# EAGLE design master_taylor2 (EAGLE 7.1.0)
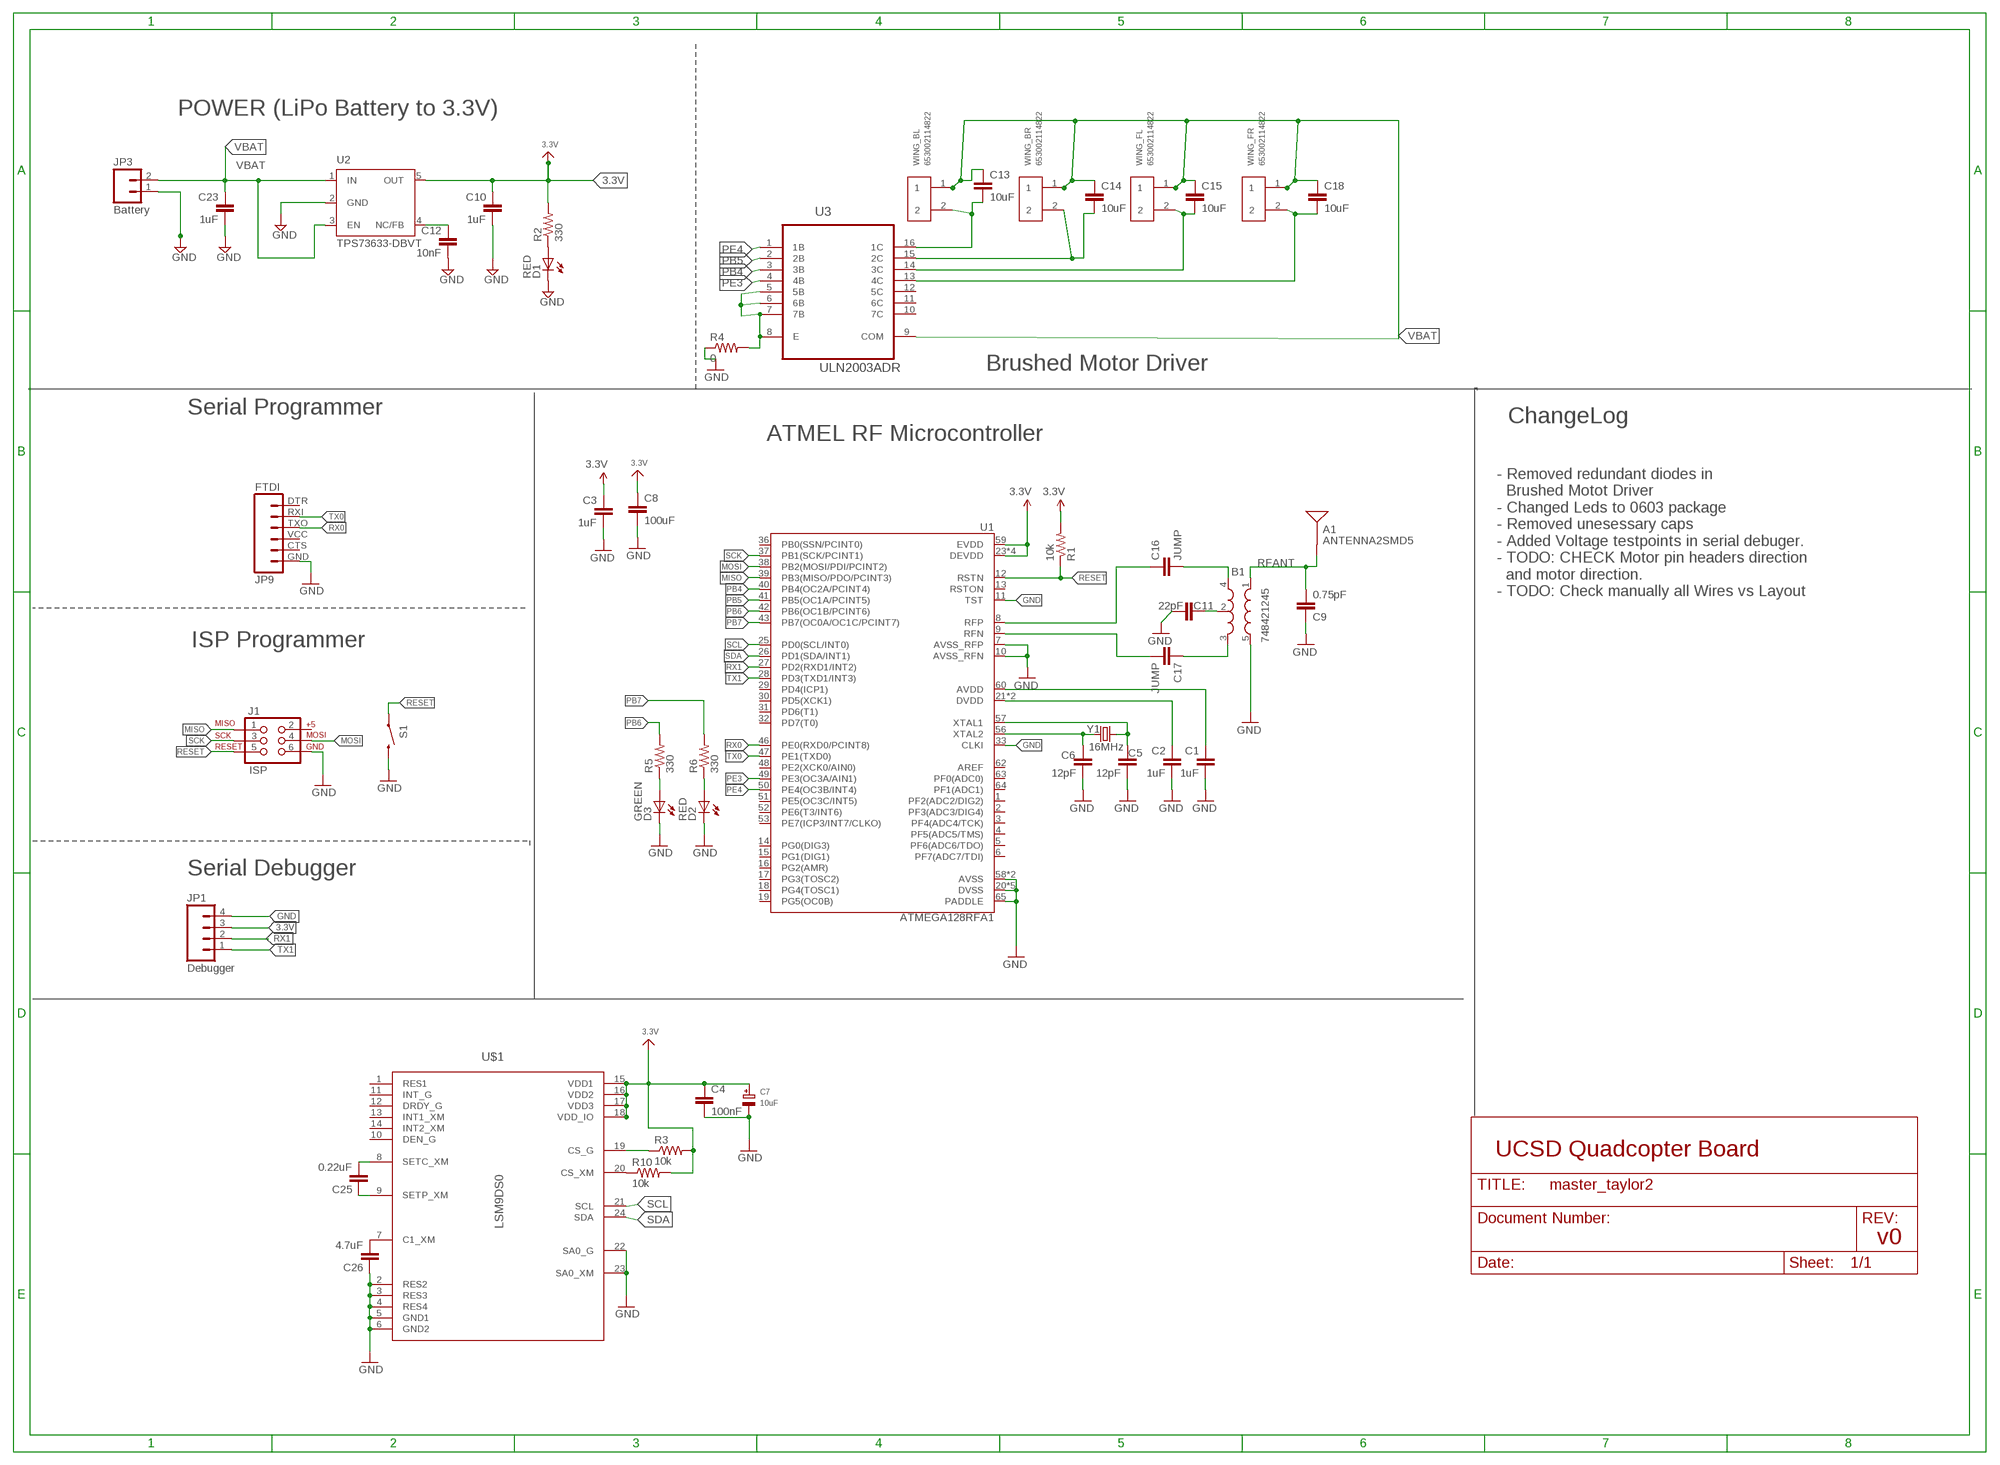
[diagram p0: schematic, sheet 1]

## Parts
A1  ANTENNA2SMD5  [ANTENNA-CHIP5]
B1  748421245  BALUN0805  [BALUN]
C1  1uF  CAP0603-CAP  [0603-CAP]
C2  1uF  CAP0603-CAP  [0603-CAP]
C3  1uF  CAP0603-CAP  [0603-CAP]
C4  100nF  CAP0603-CAP  [0603-CAP]
C5  12pF  CAP0603-CAP  [0603-CAP]
C6  12pF  CAP0603-CAP  [0603-CAP]
C7  10uF  CAP_TANTALUMA/3216_WAVE  [EIA3216-18/A-W]
C8  100uF  CAP1206  [1206]
C9  0.75pF  CAP0603-CAP  [0603-CAP]
C10  1uF  CAP0603-CAP  [0603-CAP]
C11  22pF  CAP0603-CAP  [0603-CAP]
C12  10nF  CAP0603-CAP  [0603-CAP]
C13  10uF  CAP0603-CAP  [0603-CAP]
C14  10uF  CAP0603-CAP  [0603-CAP]
C15  10uF  CAP0603-CAP  [0603-CAP]
C16  JUMP  CAP0603-CAP  [0603-CAP]
C17  JUMP  CAP0603-CAP  [0603-CAP]
C18  10uF  CAP0603-CAP  [0603-CAP]
C23  1uF  CAP0603-CAP  [0603-CAP]
C25  0.22uF  CAP0603-CAP  [0603-CAP]
C26  4.7uF  CAP0603-CAP  [0603-CAP]
D1  RED  LEDCHIPLED_0603  [CHIPLED_0603]
D2  RED  LEDCHIPLED_0603  [CHIPLED_0603]
D3  GREEN  LEDCHIPLED_0603  [CHIPLED_0603]
J1  ISP  AVR_SPI_PRG_6NS  [2X3-NS]
JP1  Debugger  M04PTH  [1X04]
JP3  Battery  M02PTH  [1X02]
JP9  FTDI  FTDI_BASICPTH  [FTDI_BASIC]
R1  10k  RESISTOR0603-RES  [0603-RES]
R2  330  RESISTOR0603-RES  [0603-RES]
R3  10k  RESISTOR0805-RES  [0805]
R4  0  RESISTOR0805-RES  [0805]
R5  330  RESISTOR0603-RES  [0603-RES]
R6  330  RESISTOR0603-RES  [0603-RES]
R10  10k  RESISTOR0805-RES  [0805]
S1  SWITCH-MOMENTARY-2SMD  [TACTILE_SWITCH_SMD]
U1  ATMEGA128RFA1  [QFN-64]
U2  TPS73633-DBVT  [SOT23-DBV]
U3  ULN2003ADR  [SOIC127P600X175-16N]
U$1  LSM9DS0  [LGA-24]
WING_BL  653002114822  [653002114822]
WING_BR  653002114822  [653002114822]
WING_FL  653002114822  [653002114822]
WING_FR  653002114822  [653002114822]
Y1  16MHz  CRYSTAL5X3  [CRYSTAL-SMD-5X3]

## Nets
3.3V: C3.1 C4.1 C7.+ C8.1 C10.1 JP1.3 R1.2 R2.2 R3.2 R10.2 U1.23(DEVDD) U1.34(DEVDD) U1.44(DEVDD) U1.54(DEVDD) U1.59(EVDD) U2.5(OUT) U$1.15(VDD1) U$1.16(VDD2) U$1.17(VDD3) U$1.18(VDD_IO)
AVDD: C1.1 U1.60(AVDD)
DVDD: C2.1 U1.21(DVDD) U1.22(DVDD)
GND: B1.5(GND) C1.2 C2.2 C3.2 C4.2 C5.2 C6.2 C7.- C8.2 C9.1 C10.2 C11.2 C12.2 C23.2 C26.1 D1.C D2.C D3.C J1.6 JP1.4 JP3.1 JP9.GND R4.1 S1.3 U1.7(AVSS_RFP) U1.10(AVSS_RFN) U1.11(TST) U1.20(DVSS) U1.24(DVSS) U1.33(CLKI) U1.35(DVSS) U1.45(DVSS) U1.55(DVSS) U1.58(AVSS) U1.61(AVSS) U1.65(PADDLE) U2.2(GND) U$1.2(RES2) U$1.3(RES3) U$1.4(RES4) U$1.5(GND1) U$1.6(GND2) U$1.22(SA0_G) U$1.23(SA0_XM)
MISO: J1.1 U1.39(PB3(MISO/PDO/PCINT3))
MOSI: J1.4 U1.38(PB2(MOSI/PDI/PCINT2))
N$1: C12.1 U2.4(NC/FB)
N$2: D1.A R2.1
N$3: C5.1 U1.57(XTAL1) Y1.3
N$4: C6.1 U1.56(XTAL2) Y1.1
N$7: B1.2(GND) C11.1
N$8: D3.A R5.1
N$10: B1.4(OUT1) C16.2
N$11: B1.3(OUT2) C17.1
N$12: R4.2 U3.5(5B) U3.6(6B) U3.7(7B) U3.8(E)
N$13: D2.A R6.1
N$20: C26.2 U$1.7(C1_XM)
N$21: C25.2 U$1.8(SETC_XM)
N$22: C25.1 U$1.9(SETP_XM)
N$23: R3.1 U$1.19(CS_G)
N$24: R10.1 U$1.20(CS_XM)
N$29: C13.2 U3.16(1C) WING_BL.2
N$30: C14.2 U3.15(2C) WING_BR.2
N$31: C15.2 U3.14(3C) WING_FL.2
N$32: C18.2 U3.13(4C) WING_FR.2
PB4: U1.40(PB4(OC2A/PCINT4)) U3.3(3B)
PB5: U1.41(PB5(OC1A/PCINT5)) U3.2(2B)
PB6: R5.2 U1.42(PB6(OC1B/PCINT6))
PB7: R6.2 U1.43(PB7(OC0A/OC1C/PCINT7))
PE3: U1.49(PE3(OC3A/AIN1)) U3.4(4B)
PE4: U1.50(PE4(OC3B/INT4)) U3.1(1B)
RESET: J1.5 R1.1 S1.1 U1.12(RSTN)
RFANT [RFSIG]: A1.FEED(SIGNAL) B1.1(IN) C9.2
RFN: C17.2 U1.9(RFN)
RFP: C16.1 U1.8(RFP)
RX0: JP9.TXO U1.46(PE0(RXD0/PCINT8))
RX1: JP1.2 U1.27(PD2(RXD1/INT2))
SCK: J1.3 U1.37(PB1(SCK/PCINT1))
SCL: U1.25(PD0(SCL/INT0)) U$1.21(SCL)
SDA: U1.26(PD1(SDA/INT1)) U$1.24(SDA)
TX0: JP9.RXI U1.47(PE1(TXD0))
TX1: JP1.1 U1.28(PD3(TXD1/INT3))
VBAT: C13.1 C14.1 C15.1 C18.1 C23.1 JP3.2 U2.1(IN) U2.3(EN) U3.9(COM) WING_BL.1 WING_BR.1 WING_FL.1 WING_FR.1
Unconnected: J1.2 JP9.CTS JP9.DTR JP9.VCC U1.1(PF2(ADC2/DIG2)) U1.2(PF3(ADC3/DIG4)) U1.3(PF4(ADC4/TCK)) U1.4(PF5(ADC5/TMS)) U1.5(PF6(ADC6/TDO)) U1.6(PF7(ADC7/TDI)) U1.13(RSTON) U1.14(PG0(DIG3)) U1.15(PG1(DIG1)) U1.16(PG2(AMR)) U1.17(PG3(TOSC2)) U1.18(PG4(TOSC1)) U1.19(PG5(OC0B)) U1.29(PD4(ICP1)) U1.30(PD5(XCK1)) U1.31(PD6(T1)) U1.32(PD7(T0)) U1.36(PB0(SSN/PCINT0)) U1.48(PE2(XCK0/AIN0)) U1.51(PE5(OC3C/INT5)) U1.52(PE6(T3/INT6)) U1.53(PE7(ICP3/INT7/CLKO)) U1.62(AREF) U1.63(PF0(ADC0)) U1.64(PF1(ADC1)) U3.10(7C) U3.11(6C) U3.12(5C) U$1.1(RES1) U$1.10(DEN_G) U$1.11(INT_G) U$1.12(DRDY_G) U$1.13(INT1_XM) U$1.14(INT2_XM)

## Notes on the sheet
- POWER (LiPo Battery to 3.3V)
- Brushed Motor Driver
- Serial Programmer
- ChangeLog
- ATMEL RF Microcontroller
- - Removed redundant diodes in 
    Brushed Motot Driver
  - Changed Leds to 0603 package
  - Removed unesessary caps
  - Added Voltage testpoints in serial debuger.
  - TODO: CHECK Motor pin headers direction
    and motor direction.
  - TODO: Check manually all Wires vs Layout
- ISP Programmer
- Serial Debugger
- UCSD Quadcopter Board
- v0

## Library data of the parts
A1 = SparkFun-RF:ANTENNA2: Chip antenna Single endded antenna. Common with smaller chip antennas. CHIP4 package is the GPS Chip Antenna SKU: GPS-08418. CHIP5 package is 2.4GHz chip antenna SKU: WRL-00144.
B1 = SparkFun-RF:BALUN: 0805 footprint balun- Ember 351/357
C1-C6 C8-C18 C23 C25 C26 = SparkFun-Capacitors:CAP: Capacitor Standard 0603 ceramic capacitor, and 0.1" leaded capacitor.
C7 = microbuilder:CAP_TANTALUM: Tantalum Capacitors Wave footprints have larger pads and are meant to be used for hand soldering. Reflow footprints are optimised for solder paste and a reflow oven. EIA3216-18/A-[R/W] - Size A / 3216-18 / 1206 footprint 4.7µF 25V 10% Tantalum Capacitor 10µF 16V 10% Tantalum Capacitor [Digikey: 495-2236-2-ND] EIA3528-21/B-[R/W] - Size B / 3528-21 47µF 10V 10% Tantalum Capactior [Digikey: 495-2216-1-ND] EIA6032-28/C-[R/W] - Size C / 6032-28 10µF 35V 20% Tantalum Capacitor [Digikey: 495-2285-1-ND] 100µF 16V 10% Tantalum Capactior [Digikey: 399-5214-1-ND]
D1-D3 = led:LED: LED OSRAM: - CHIPLED LG R971, LG N971, LY N971, LG Q971, LY Q971, LO R971, LY R971 LH N974, LH R974 LS Q976, LO Q976, LY Q976 LO Q996 - Hyper CHIPLED LW Q18S LB Q993, LB Q99A, LB R99A - SideLED LS A670, LO A670, LY A670, LG A670, LP A670 LB A673, LV A673, LT A673, LW A673 LH A674 LY A675 LS A676, LA A676, LO A676, LY A676, LW A676 LS A679, LY A679, LG A679 - Hyper Micro SIDELED® LS Y876, LA Y876, LO Y876, LY Y876 LT Y87S - SmartLED LW L88C, LW L88S LB L89C, LB L89S, LG L890 LS L89K, LO L89K, LY L89K LS L896, LA L896, LO L896, LY L896 - TOPLED LS T670, LO T670, LY T670, LG T670, LP T670 LSG T670, LSP T670, LSY T670, LOP T670, LYG T670 LG T671, LOG T671, LSG T671 LB T673, LV T673, LT T673, LW T673 LH T674 LS T676, LA T676, LO T676, LY T676, LB T676, LH T676, LSB T676, LW T676 LB T67C, LV T67C, LT T67C, LS T67K, LO T67K, LY T67K, LW E67C LS E67B, LA E67B, LO E67B, LY E67B, LB E67C, LV E67C, LT E67C LW T67C LS T679, LY T679, LG T679 LS T770, LO T770, LY T770, LG T770, LP T770 LB T773, LV T773, LT T773, LW T773 LH T774 LS E675, LA E675, LY E675, LS T675 LS T776, LA T776, LO T776, LY T776, LB T776 LHGB T686 LT T68C, LB T68C - Hyper Mini TOPLED® LB M676 - Mini TOPLED Santana® LG M470 LS M47K, LO M47K, LY M47K Source: http://www.osram.convergy.de LUXEON: - LUMILED® LXK2-PW12-R00, LXK2-PW12-S00, LXK2-PW14-U00, LXK2-PW14-V00 LXK2-PM12-R00, LXK2-PM12-S00, LXK2-PM14-U00 LXK2-PE12-Q00, LXK2-PE12-R00, LXK2-PE12-S00, LXK2-PE14-T00, LXK2-PE14-U00 LXK2-PB12-K00, LXK2-PB12-L00, LXK2-PB12-M00, LXK2-PB14-N00, LXK2-PB14-P00, LXK2-PB14-Q00 LXK2-PR12-L00, LXK2-PR12-M00, LXK2-PR14-Q00, LXK2-PR14-R00 LXK2-PD12-Q00, LXK2-PD12-R00, LXK2-PD12-S00 LXK2-PH12-R00, LXK2-PH12-S00 LXK2-PL12-P00, LXK2-PL12-Q00, LXK2-PL12-R00 Source: www.luxeon.com KINGBRIGHT: KA-3528ASYC Source: www.kingbright.com
J1 = SparkFun-Connectors:AVR_SPI_PRG_6: AVR ISP 6 Pin This is the reduced ISP connector for AVR programming. Common on Arduino. This footprint will take up less PCB space and can be used with a 10-pin to 6-pin adapter such as SKU: BOB-08508
JP1 = SparkFun-Connectors:M04: Header 4 Standard 4-pin 0.1" header. Use with straight break away headers (SKU : PRT-00116), right angle break away headers (PRT-00553), swiss pins (PRT-00743), machine pins (PRT-00117), and female headers (PRT-00115). Molex polarized connector foot print use with SKU : PRT-08231 with associated crimp pins and housings. 1MM SMD Version SKU: PRT-10208
JP3 = SparkFun:M02: Header 2 Standard 2-pin 0.1" header. Use with straight break away headers (SKU : PRT-00116), right angle break away headers (PRT-00553), swiss pins (PRT-00743), machine pins (PRT-00117), and female headers (PRT-00115). Molex polarized connector foot print use with SKU : PRT-08233 with associated crimp pins and housings.
JP9 = SparkFun-Connectors:FTDI_BASIC: FTDI Basic header with labels
R1 R2 R5 R6 = SparkFun-Resistors:RESISTOR: Resistor Basic schematic elements and footprints for 0603, 1206, and PTH resistors.
R3 R4 R10 = SparkFun-Passives:RESISTOR: Resistor Basic schematic elements and footprints for 0603, 1206, and PTH resistors.
S1 = SparkFun-Electromechanical:SWITCH-MOMENTARY-2: Various NO switches- pushbuttons, reed, etc
U1 = master_devon:ATMEGA128RFA1: ATmega128RFA1 8-bit AVR Microcontroller with Low Power 2.4GHz Transceiver for ZigBee and IEEE 802.15.4
U2 = Power:TPS73633-DBVT
U3 = Texas Instruments_By_element14_Batch_1:ULN2003ADR: 8-BIT SHIFT REGISTERS WITH 3-STATE OUTPUT REGISTERS; MPN: ULN2003ADR; OC_FARNELL: 1470513; OC_NEWARK: 77C3560; PACKAGE: SOIC-16; SUPPLIER: TEXAS INSTRUMENTS
U$1 = IMU_parts:LSM9DS0
WING_BL WING_BR WING_FL WING_FR = Wuerth_Elektronik_eiCan_Wire_to_Board_Connectors:653002114822: WR-WTB 1.25mm Male Vertical Shrouded Header, 2 Pins=>Code : Con_WTB_1.25_PCB_THT_653002114822 <http://katalog.we-online.de/media/thumbs2/eican/thb_Con_WTB_1.25_PCB_THT_6530xx114822_pf2.jpg> Details see: http://katalog.we-online.de/en/em/653_0xx_114_822 Created 2014-06-06, Karrer Zheng 2014 (C) Würth Elektronik; OC_FARNELL: unknown
Y1 = SparkFun-FreqCtrl:CRYSTAL: Various standard crystals. Proven footprints. Spark Fun Electronics SKU : COM-00534

## Net classes
1 RFSIG: width 0.457 mm, clearance 0.205 mm to class 0, clearance 0.205 mm

## Board
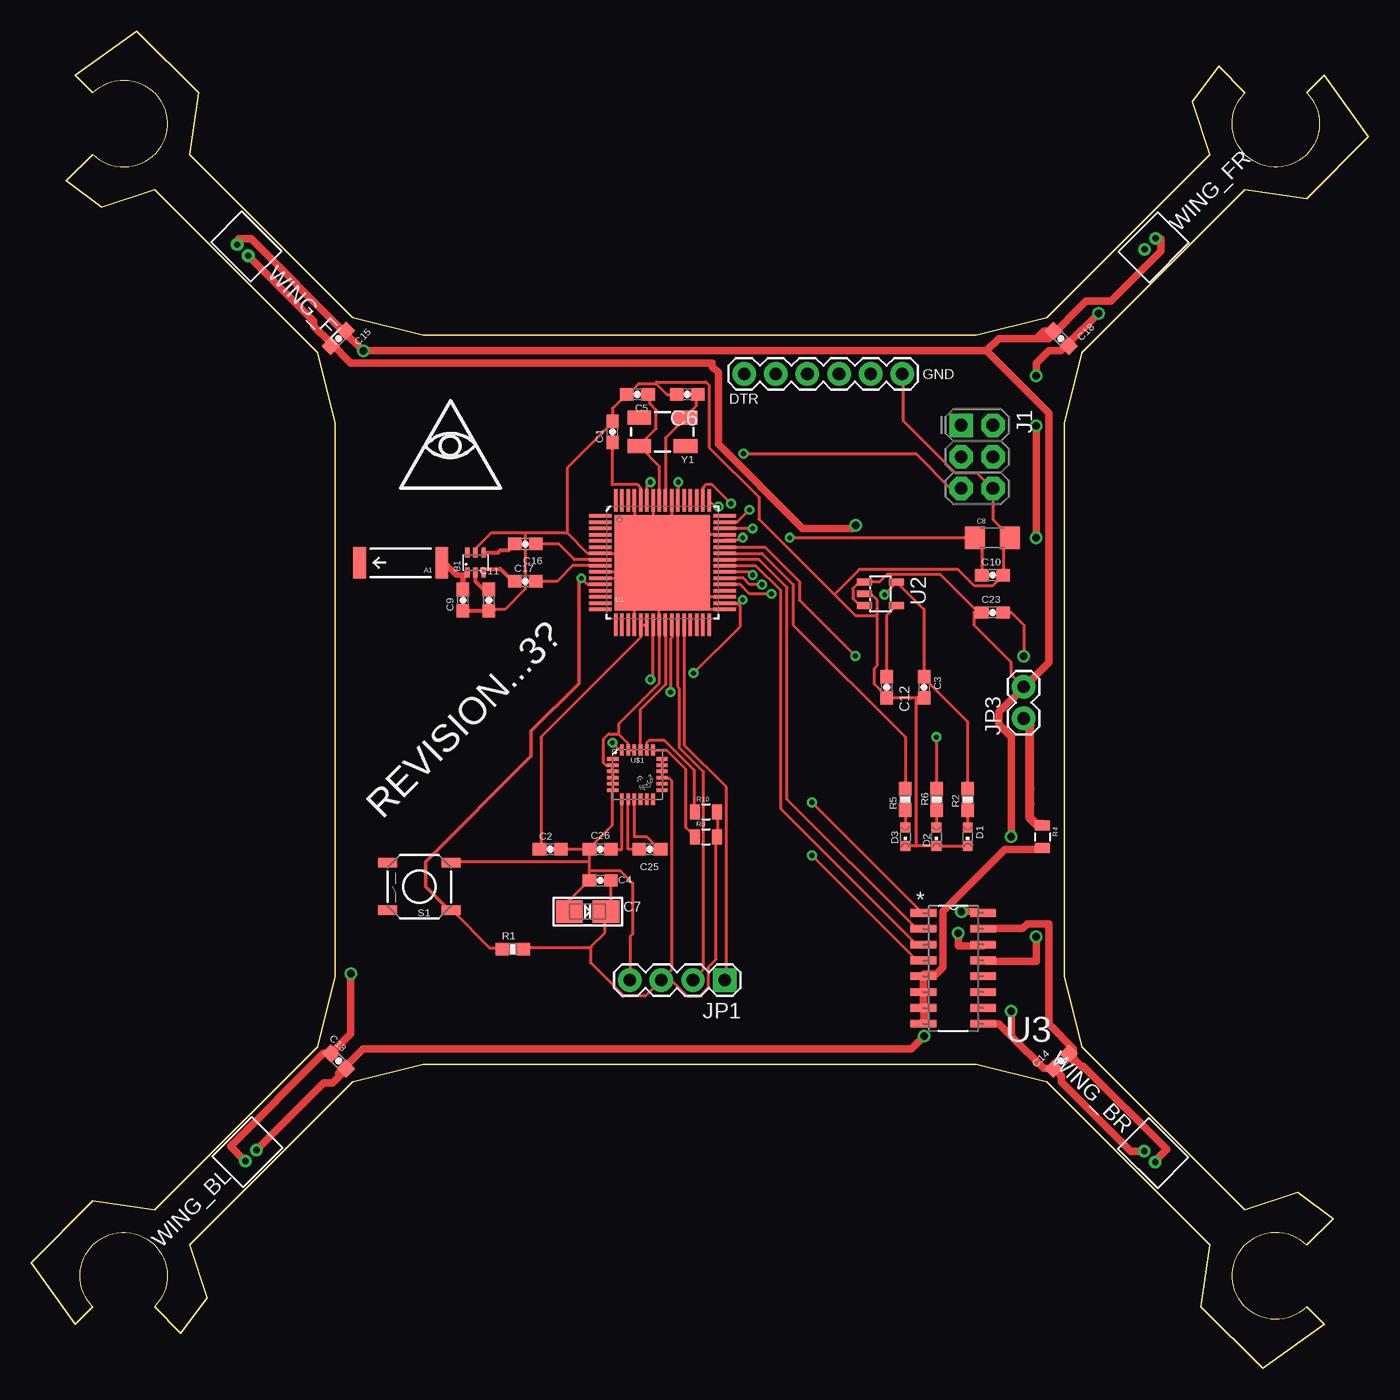
[diagram p1: board, top side]
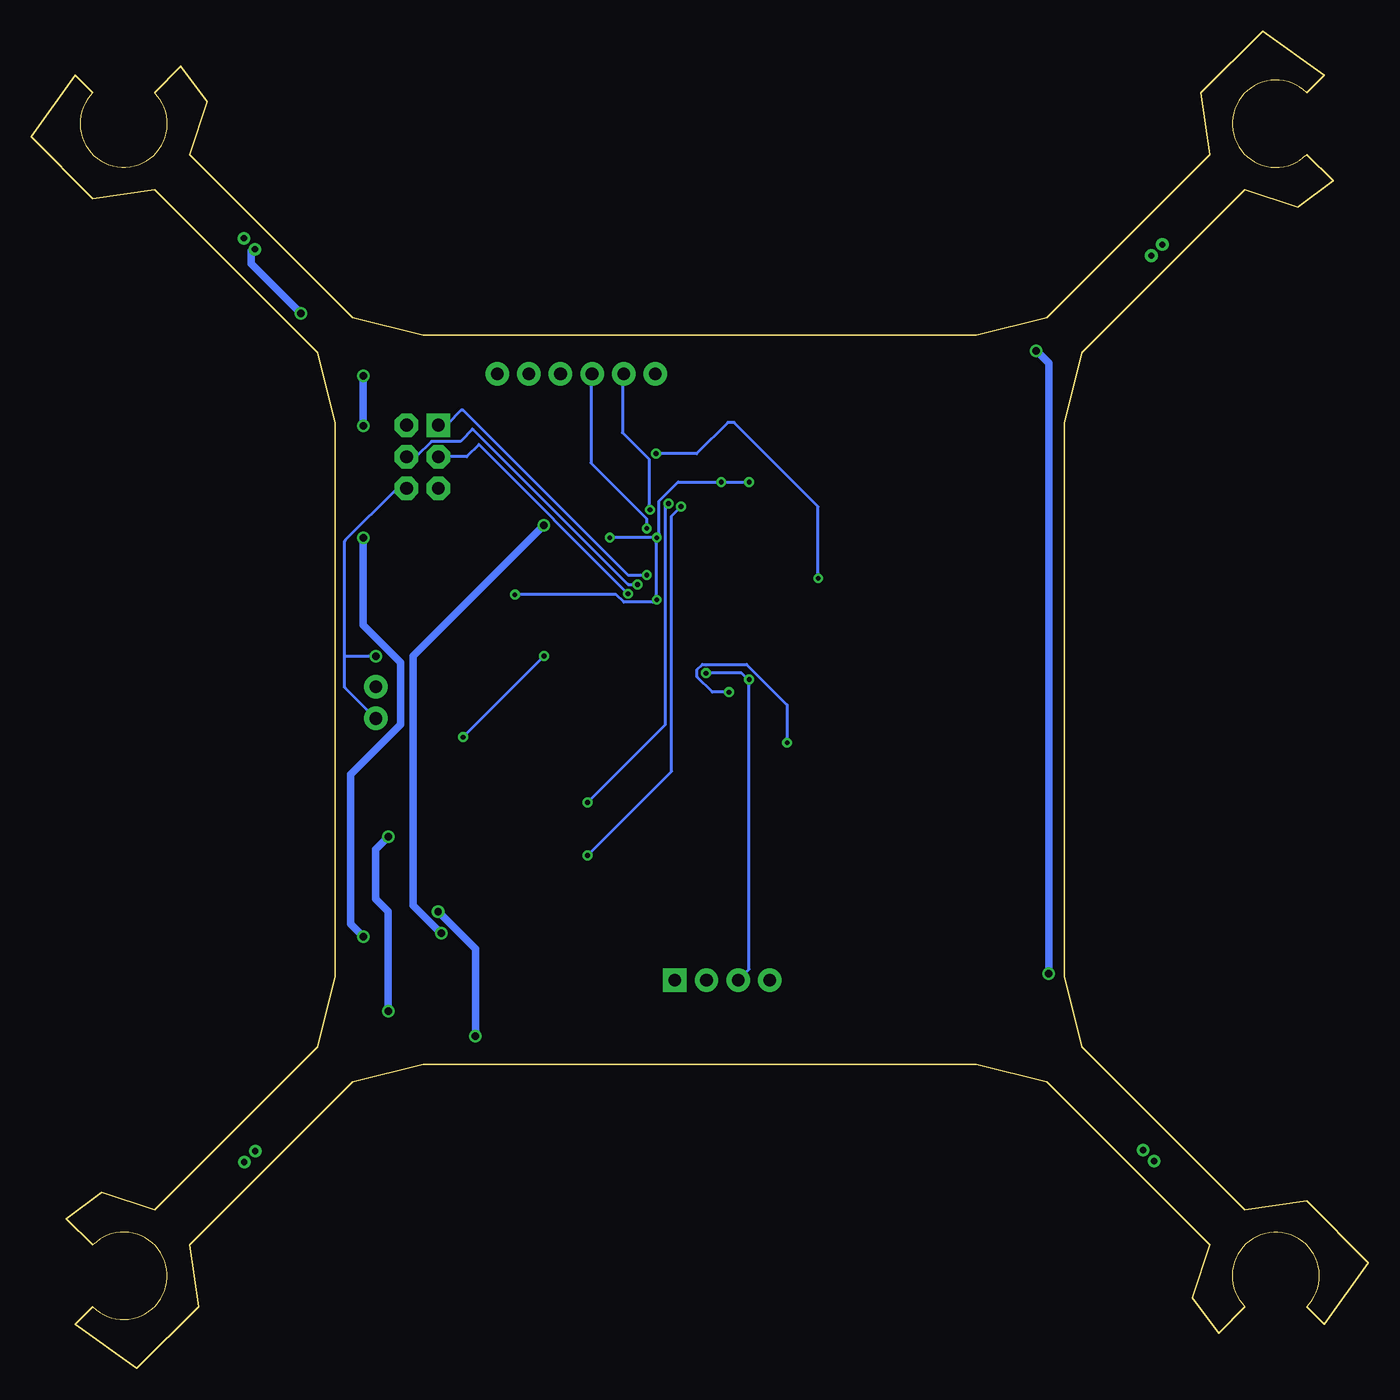
[diagram p2: board, bottom side, seen from below]

Size 107.32 x 107.32 mm. Coordinates in mm from the lower left corner, seen from the top.
Copper layers (1*16): Top 0.035559375mm / dielectric 1.501140625mm / Bottom 0.035559375mm
Design rules "4pcb-33board": minimum track width 10mil, minimum drill 15mil, track to track 6mil, track to pad 6mil, pad to pad 6mil, via to via 6mil, smd to smd 6mil, copper to edge 10mil, drill to drill 10mil, minimum pad ring 10mil, minimum via ring 8mil, stop-mask expansion 4mil, vias tented up to drill 0mil, thermal gap 10mil
tRestrict: area 26.4,63.4 to 32.9,65.9

### Footprints (pad centres in the part's own frame; a part is rotated, then mirrored left to right if it is on the bottom)
ANTENNA-CHIP5 = smd 1.016 x 2.54: FEED -3.302,0; NC 3.302,0
BALUN = smd 0.35 x 0.8: 1 -0.65,-0.8; 2 0,-0.8; 3 0.65,-0.8; 4 0.65,0.8; 5 0,0.8; 6 -0.65,0.8
0603-CAP = smd 1.1 x 1: 1 -0.85,0; 2 0.85,0
EIA3216-18/A-W = smd 2.15 x 1.8: + 1.475,0; - -1.475,0
1206 = smd 1.6 x 1.8: 1 -1.4,0; 2 1.4,0
CHIPLED_0603 = smd 0.8 x 0.8: A 0,-0.75; C 0,0.75
2X3-NS = drill 1.016 pad 1.88 square: 1 -2.54,-1.27 | drill 1.016 pad 1.88 octagon: 2 -2.54,1.27; 3 0,-1.27; 4 0,1.27; 5 2.54,-1.27; 6 2.54,1.27
1X04 = drill 1.016 pad 1.88 square: 1 0,0 | drill 1.016 pad 1.88: 2 2.54,0; 3 5.08,0; 4 7.62,0
1X02 = drill 1.016 pad 1.88: 1 0,0; 2 2.54,0
FTDI_BASIC = drill 1.016 pad 1.88: CTS 10.16,0; DTR 0,0; GND 12.7,0; RXI 2.54,0; TXO 5.08,0; VCC 7.62,0
0603-RES = smd 1.1 x 1: 1 -0.85,0; 2 0.85,0
0805 = smd 0.8 x 1.2: 1 -0.9,0; 2 0.9,0
TACTILE_SWITCH_SMD = smd 1.524 x 0.762: 1 -2.54,1.905; 2 2.54,1.905; 3 -2.54,-1.905; 4 2.54,-1.905
QFN-64 = smd 1.8 x 0.28: 1 -5,3.75; 2 -5,3.25; 3 -5,2.75; 4 -5,2.25; 5 -5,1.75; 6 -5,1.25; 7 -5,0.75; 8 -5,0.25; 9 -5,-0.25; 10 -5,-0.75; 11 -5,-1.25; 12 -5,-1.75; 13 -5,-2.25; 14 -5,-2.75; 15 -5,-3.25; 16 -5,-3.75; 33 5,-3.75; 34 5,-3.25; 35 5,-2.75; 36 5,-2.25; 37 5,-1.75; 38 5,-1.25; 39 5,-0.75; 40 5,-0.25; 41 5,0.25; 42 5,0.75; 43 5,1.25; 44 5,1.75; 45 5,2.25; 46 5,2.75; 47 5,3.25; 48 5,3.75 | smd 0.28 x 1.8: 17 -3.75,-5; 18 -3.25,-5; 19 -2.75,-5; 20 -2.25,-5; 21 -1.75,-5; 22 -1.25,-5; 23 -0.75,-5; 24 -0.25,-5; 25 0.25,-5; 26 0.75,-5; 27 1.25,-5; 28 1.75,-5; 29 2.25,-5; 30 2.75,-5; 31 3.25,-5; 32 3.75,-5; 49 3.75,5; 50 3.25,5; 51 2.75,5; 52 2.25,5; 53 1.75,5; 54 1.25,5; 55 0.75,5; 56 0.25,5; 57 -0.25,5; 58 -0.75,5; 59 -1.25,5; 60 -1.75,5; 61 -2.25,5; 62 -2.75,5; 63 -3.25,5; 64 -3.75,5 | smd 7.65 x 7.65: 65 0,0
SOT23-DBV = smd 0.55 x 1.2: 1 -0.95,-1.3; 2 0,-1.3; 3 0.95,-1.3; 4 0.95,1.3; 5 -0.95,1.3
SOIC127P600X175-16N = smd 2.057 x 0.61: 1 -4.801,8.89; 2 -4.801,7.62; 3 -4.801,6.35; 4 -4.801,5.08; 5 -4.801,3.81; 6 -4.801,2.54; 7 -4.801,1.27; 8 -4.801,0; 9 0,0; 10 0,1.27; 11 0,2.54; 12 0,3.81; 13 0,5.08; 14 0,6.35; 15 0,7.62; 16 0,8.89
LGA-24 = smd 0.9 x 0.29: 1 -1.975,1.25; 2 -1.975,0.75; 3 -1.975,0.25; 4 -1.975,-0.25; 5 -1.975,-0.75; 6 -1.975,-1.25; 13 1.975,-1.25; 14 1.975,-0.75; 15 1.975,-0.25; 16 1.975,0.25; 17 1.975,0.75; 18 1.975,1.25 | smd 0.29 x 0.9: 7 -1.25,-1.975; 8 -0.75,-1.975; 9 -0.25,-1.975; 10 0.25,-1.975; 11 0.75,-1.975; 12 1.25,-1.975; 19 1.25,1.975; 20 0.75,1.975; 21 0.25,1.975; 22 -0.25,1.975; 23 -0.75,1.975; 24 -1.25,1.975
653002114822 = drill 0.5: 1 0.625,0; 2 -0.625,0
CRYSTAL-SMD-5X3 = smd 1.9 x 1.1: 1 -1.85,-1.15; 2 1.85,-1.15; 3 1.85,1.15; 4 -1.85,1.15

### Placement (x,y rotation side)
A1  29.66,64.66 180 top
B1  35.66,64.66 0 top
C1  46.66,75.16 90 top
C2  41.66,41.66 0 top
C3  71.66,54.66 270 top
C4  45.66,39.16 180 top
C5  48.66,78.16 180 top
C6  52.66,78.16 180 top
C7  44.66,36.66 0 top
C8  77.16,66.66 0 top
C9  34.66,61.66 90 top
C10  77.16,63.66 0 top
C11  36.73,61.66 270 top
C12  68.66,54.66 270 top
C13  24.66,24.66 315 top
C14  82.66,24.66 45 top
C15  24.66,82.66 225 top
C16  39.66,66.16 180 top
C17  39.66,63.16 0 top
C18  82.66,82.66 315 top
C23  77.16,60.66 0 top
C25  49.66,41.66 180 top
C26  45.66,41.66 0 top
D1  75.16,42.66 180 top
D2  72.66,42.66 180 top
D3  70.16,42.66 180 top
J1  75.92,73.16 270 top
JP1  55.66,31.16 180 top
JP3  79.66,52.16 90 top
JP9  57.22,79.82 0 top
R1  38.66,33.66 0 top
R2  75.16,45.66 90 top
R3  54.16,42.66 0 top
R4  81.16,42.66 270 top
R5  70.16,45.66 90 top
R6  72.66,45.66 90 top
R10  54.16,44.66 0 top
S1  31.16,38.66 180 top
U1  50.66,64.66 0 top
U2  68.16,62.16 270 top
U3  76.41,27.66 0 top
U$1  48.66,47.66 0 top
U$4  [QUAD_WING]  66.66,66.66 315 top
U$5  [QUAD_WING]  40.66,66.66 45 top
U$6  [QUAD_WING]  40.66,40.66 135 top
U$7  [QUAD_WING]  66.66,40.66 225 top
WING_BL  17.63,17.07 225 top
WING_BR  89.77,16.99 135 top
WING_FL  16.97,89.74 135 top
WING_FR  89.8,90.26 45 top
Y1  50.66,75.16 180 top

### Tracks (layer width: path | path; a pad name or v marks a point on that pad's centre or on a via)
3.3V  (via drill 0.38)
  Top 0.254: C10.1 76.28,63.66 76.28,66.16 75.78,66.66 C8.1 75.71,66.66 v60.87,66.66 | R2.2 75.16,51.91 71.66,55.41 C3.1 71.66,60.91 U2.5 69.41,63.01 v68.49,62.09 | R10.2 55.08,44.62 55.08,42.69 R3.2 54.98,42.58 54.98,32.83 54.37,32.22 54.37,30.6 53.66,29.88 52.64,29.88 51.02,31.51 JP1.3 | U$1.18 50.61,48.88 50.61,48.48 U$1.17 50.61,48.38 50.61,47.97 U$1.16 50.61,47.87 50.61,47.46 U$1.15 50.71,47.36 51.22,47.36 51.42,47.16 51.42,32.02 50.61,31.2 JP1.3 | v49.7,55.28 49.9,55.49 U1.23 | 56.71,61.38 55.69,61.38 U1.34 | 56.71,61.38 56.91,61.18 56.91,59.55 v53.15,55.79 | v57.11,66.66 56.91,66.46 55.69,66.46 U1.44 | v57.11,61.68 56.81,61.38 56.71,61.38 | v49.7,71.13 49.39,70.83 49.39,69.71 U1.59 | v51.93,71.13 51.93,69.71 U1.54 | 44.92,33.74 39.54,33.74 R1.2 | 46.55,39.13 C4.1 46.55,39.03 46.55,37.1 46.14,36.69 C7.+ 46.04,36.59 46.04,34.96 44.92,33.85 44.92,33.74 | 44.92,33.74 44.92,32.53 47.56,29.88 49.29,29.88 50.51,31.1 JP1.3
  Bottom 0.254: JP1.3 50.51,31.2 49.7,32.02 v49.7,55.28 49.8,55.28 50.31,55.79 v53.15,55.79 | v57.11,66.66 v57.11,61.68 57.21,61.68 57.42,61.48 59.75,61.48 60.36,62.09 v68.49,62.09 | v49.7,71.13 v51.93,71.13 55.39,71.13 56.91,69.61 56.91,66.97 57.11,66.76 v57.11,66.66 | v57.11,66.66 v60.87,66.66
AVDD
  Top 0.254: C1.1 46.66,70.91 48.66,70.91 48.91,70.66 U1.60
DVDD
  Top 0.254: U1.22 U1.21 48.91,58.66 40.91,50.66 40.91,41.66 C2.1
GND  (via drill 0.6)
  Top 0.254: U1.11 47.45,63.41 | 47.45,63.41 47.27,63.59 47.27,63.91 | 47.27,63.91 46.95,63.91 U1.10 | U1.55 arc90 U1.55 51.41,67.15 | 51.41,67.15 51.29,67.15 arc90 50.66,66.52 | 50.66,66.52 U1.65 50.66,64.04 arc-90 50.02,63.41 49.66,63.41 | U1.20 arc90 U1.20 48.42,61.71 48.09,61.71 arc-90 47.45,62.34 47.45,63.41 | 47.45,63.41 49.66,63.41 | 50.41,61.62 U1.24 arc90 U1.24 50.41,59.55 50.41,54.98 47.16,51.73 47.16,50.92 | 50.41,61.62 50.29,61.62 arc-90 49.66,62.26 49.66,63.41 | U1.45 51.65,66.91 arc-90 51.41,67.15 | U1.35 53.91,61.91 arc90 53.66,61.66 | U1.33 54.41,60.91 53.66,61.66 | U1.61 48.41,67.92 48.71,67.61 49.91,67.61 U1.58 49.91,67.62 50.02,67.62 50.66,66.98 50.66,66.52 | 47.27,63.91 47.27,65.04 46.91,65.41 U1.7 44.66,65.41 43.03,67.03 | 53.66,61.66 50.44,61.66 50.41,61.62 | C8.2 78.53,66.66 78.03,66.16 78.03,63.66 C10.2 77.94,63.62 77.13,62.8 75.71,62.8 74.38,64.12 66.46,64.12 64.45,62.12 | 78.53,66.78 C8.2 | 71.03,53.78 71.66,53.78 C3.2 | 71.03,53.78 68.66,53.78 C12.2 68.66,53.91 67.66,54.91 67.66,56.16 67.91,56.41 67.91,60.41 | 71.03,41.91 D2.C D1.C 75.28,41.91 | 71.03,41.91 D3.C | 78.03,60.66 C23.2 78.66,60.66 79.66,59.66 v79.66,57.16 | 80.41,45.28 80.16,45.28 | 79.91,46.53 80.16,46.53 | 71.03,41.91 71.03,53.78 | C6.2 51.03,78.16 50.16,79.03 | 50.16,79.03 48.78,79.03 47.91,78.16 C5.2 47.78,78.16 46.66,77.03 C1.2 46.66,75.91 43.03,72.28 43.03,67.03 | B1.5 35.66,65.78 36.91,67.03 39.66,67.03 | 43.03,67.03 39.66,67.03 | 39.66,67.03 39.66,62.53 38.03,60.91 36.91,60.91 C11.2 36.78,60.91 | C26.1 C2.2 | 44.78,40.66 44.78,41.53 C26.1 | 44.78,40.66 44.78,39.94 | 44.78,39.94 44.78,39.16 C4.2 44.72,39.13 43.19,37.61 43.19,36.69 C7.-
  Top 0.254: U$1.22 U$1.23 47.87,49.7 47.87,50.2 47.16,50.92 | 44.78,40.66 33.91,40.66 S1.3 | U2.2 67.41,62.16 67.91,61.66 67.91,60.41 | 67.91,60.41 66.16,60.41 64.45,62.12 | 64.45,62.12 58.41,68.16 58.41,69.91 54.41,73.91 54.41,78.91 54.16,79.16 50.16,79.16 50.16,79.03 | 47.16,50.92 46.34,50.92 45.94,50.51 45.94,48.58 46.14,48.38 46.55,48.38 U$1.2 46.65,48.38 46.65,47.97 U$1.3 46.65,47.87 46.65,47.46 U$1.4 46.65,47.36 46.65,46.95 U$1.5 46.65,46.85 46.65,46.44 U$1.6 46.65,46.34 46.65,43.6 44.82,41.77 C26.1 | 44.78,39.94 47.26,39.94 48.27,38.93 48.27,34.86 48.07,34.66 48.07,31.2 JP1.4 | JP9.GND 70.02,79.77 70.02,76.01 74.18,71.84 75.91,71.84 77.13,70.63 J1.6 77.23,70.52 77.23,68.09 78.45,66.87 C8.2
  Top 0.305: C9.1 C11.2
  Top 0.71: R4.1 81.16,43.66 80.66,43.66 80.16,44.16 80.16,45.28 80.16,46.53 80.16,51.66 JP3.1
  Bottom 0.254: 82.16,57.16 82.16,54.66 JP3.1 | 82.16,57.16 82.16,66.41 82.11,66.46 78.04,70.52 77.23,70.52 J1.6 | 82.16,57.16 v79.66,57.16
MISO  (via drill 0.38)
  Top 0.254: U1.39 57.66,63.91 v57.91,63.66
  Bottom 0.254: v57.91,63.66 59.41,63.66 72.66,76.91 72.76,76.92 73.98,75.71 74.59,75.71 J1.1
MOSI  (via drill 0.38)
  Top 0.254: U1.38 57.16,63.41 57.66,62.91 v58.66,62.91
  Bottom 0.254: v58.66,62.91 59.41,62.91 71.87,75.37 | 71.91,75.41 71.87,75.37 | 71.87,75.37 72.86,74.38 75.2,74.38 76.42,73.17 77.13,73.17 J1.4
N$1
  Top 0.254: C12.1 68.66,60.41 U2.4
N$2
  Top 0.254: R2.1 D1.A
N$3
  Top 0.254: C5.1 49.66,78.16 49.66,77.41 50.16,76.91 50.16,75.41 48.91,74.16 Y1.3 50.41,72.41 U1.57
N$4
  Top 0.254: C6.1 53.41,78.16 53.41,77.28 52.53,76.41 Y1.1 52.41,76.16 50.91,74.66 U1.56
N$7
  Top 0.305: C11.1 36.31,62.51 35.66,63.16 B1.2
N$8
  Top 0.254: R5.1 D3.A
N$10
  Top 0.305: B1.4 37.46,65.46 37.66,65.66 38.31,65.66 C16.2
N$11
  Top 0.305: C17.1 38.66,63.16 37.66,64.16 36.16,64.16 B1.3
N$12
  Top 0.61: U3.8 71.66,27.66 71.66,28.66 U3.7 U3.6 U3.5 71.66,31.66 72.66,31.66 73.16,32.16 73.16,36.66 78.16,41.66 81.16,41.66 R4.2
N$13
  Top 0.254: R6.1 D2.A
N$20
  Top 0.254: U$1.7 47.41,41.66 C26.2
N$21
  Top 0.254: U$1.8 47.91,41.66 C25.2
N$22
  Top 0.254: U$1.9 48.41,42.66 49.41,42.66 50.41,41.66 C25.1
N$23
  Top 0.254: U$1.19 50,49.59 51.02,49.59 52.54,48.07 52.54,43.4 53.25,42.69 R3.1
N$24
  Top 0.254: U$1.20 49.39,49.7 49.39,50.2 49.59,50.41 50.81,50.41 53.25,47.97 53.25,44.72 R10.1
N$29  (via drill 0.6)
  Top 0.61: WING_BL.2 23.48,22.92 24.19,22.92 24.8,23.52 | 24.8,23.52 25.26,23.99 C13.2 | v71.66,26.66 70.66,25.66 26.66,25.66 24.66,23.66 24.8,23.52 | v74.66,36.66 75.66,36.66 U3.16
  Bottom 0.61: v71.66,26.66 71.66,33.66 v74.66,36.66
N$30
  Top 0.61: WING_BR.2 90.21,16.64 91.14,17.56 84.45,24.25 84.27,24.25 83.76,24.76 | 83.76,24.76 C14.2 | 83.76,24.76 83.66,24.66 83.66,25.66 81.66,27.66 81.66,35.66 79.94,35.66 79.57,35.29 U3.15
N$31  (via drill 0.6)
  Top 0.61: WING_FL.2 22.66,84.06 22.66,83.66 24.06,82.26 | 24.06,82.26 C15.2 | 24.06,82.26 25.66,80.66 54.66,80.66 54.66,80.41 55.16,79.91 55.16,74.16 61.91,67.41 65.91,67.41 v66.16,67.66 | v74.41,34.91 74.41,33.91 76.41,33.91 U3.14
  Bottom 0.61: v74.41,34.91 76.66,37.16 76.66,57.16 v66.16,67.66
N$32  (via drill 0.6)
  Top 0.61: v85.66,84.66 83.26,82.26 | 83.26,82.26 C18.2 | v80.66,34.66 80.66,32.66 76.66,32.66 U3.13 | v80.66,75.66 v80.66,66.66 | v80.66,79.66 80.66,80.66 81.66,81.66 82.66,81.66 83.26,82.26
  Bottom 0.61: v85.66,84.66 89.66,88.66 89.66,89.66 WING_FR.2 | v80.66,34.66 81.66,35.66 81.66,47.66 77.66,51.66 77.66,56.66 80.66,59.66 v80.66,66.66 | v80.66,79.66 v80.66,75.66
PB4
  Top 0.254: U1.40 58.16,64.41 60.16,62.41 60.16,44.91 70.91,34.16 71.41,34.16 U3.3
PB5
  Top 0.254: U1.41 58.41,64.91 60.66,62.66 60.66,45.66 70.91,35.41 71.41,35.41 U3.2
PB6
  Top 0.254: R5.2 70.16,50.66 61.16,59.66 61.16,62.91 58.66,65.41 U1.42
PB7  (via drill 0.38)
  Top 0.254: v72.66,50.66 R6.2 | v66.16,57.16 61.66,61.66 61.66,63.16 58.91,65.91 U1.43
  Bottom 0.254: v66.16,57.16 v72.66,50.66
PE3  (via drill 0.38)
  Top 0.254: U1.49 54.91,69.16 v55.16,69.16 | v62.66,41.16 70.91,32.91 71.41,32.91 U3.4
  Bottom 0.254: v55.16,69.16 55.91,68.41 55.91,47.91 v62.66,41.16
PE4  (via drill 0.38)
  Top 0.254: U1.50 53.91,70.66 54.16,70.91 54.66,70.91 v56.16,69.41 | v62.66,45.41 71.41,36.66 U3.1
  Bottom 0.254: v56.16,69.41 56.41,69.16 56.41,51.66 v62.66,45.41
RESET  (via drill 0.38)
  Top 0.254: U1.12 44.66,62.91 v44.16,63.41 | 33.66,36.91 S1.1 33.85,36.69 36.79,33.74 37.71,33.74 R1.1 | v57.16,73.41 70.91,73.41 71.03,73.37 73.78,70.63 74.59,70.63 J1.5
  Top 0.3: S1.1 33.56,36.75 31.66,38.66 31.66,40.65 40.14,49.13 40.14,51.15 43.95,54.96 43.95,63.2 v44.16,63.41
  Bottom 0.254: v57.16,73.41 53.91,73.41 51.41,75.91 50.91,75.91 44.16,69.16 v44.16,63.41
RFANT
  Top 0.254: 33.16,64.66 A1.FEED
  Top 0.457: 33.16,64.66 34.16,63.66 34.81,63.66 B1.1 34.66,63.51 C9.2
RFN
  Top 0.254: U1.9 43.45,64.41 42.2,63.16 C17.2
RFP
  Top 0.254: U1.8 43.6,64.91 42.35,66.16 C16.1
RX0  (via drill 0.38)
  Top 0.254: v57.91,67.41 U1.46
  Bottom 0.254: 62.4,79.77 JP9.TXO 62.4,79.67 62.4,72.66 57.93,68.19 57.93,67.48 v57.91,67.41
RX1
  Top 0.254: U1.27 51.93,59.65 51.93,54.67 52.03,54.57 52.03,49.8 53.96,47.87 53.96,32.02 53.15,31.2 JP1.2
SCK  (via drill 0.38)
  Top 0.254: U1.37 56.91,62.91 57.66,62.16 v59.41,62.16
  Bottom 0.254: 71.41,74.16 71.38,74.13 | 71.38,74.13 v59.41,62.16 | 71.38,74.13 72.35,73.17 74.59,73.17 J1.3
SCL
  Top 0.254: U$1.21 48.88,49.7 48.88,52.85 50.92,54.88 U1.25
SDA  (via drill 0.38)
  Top 0.254: v46.65,50.2 47.16,49.7 47.36,49.7 U$1.24 | v51.32,54.27 51.32,58.54 51.42,58.64 51.42,59.65 U1.26
  Bottom 0.254: v46.65,50.2 46.65,53.25 49.9,56.5 53.46,56.5 53.86,56.1 53.86,55.49 52.64,54.27 v51.32,54.27
TX0  (via drill 0.38)
  Top 0.254: U1.47 56.66,67.91 v57.66,68.91
  Bottom 0.254: 59.86,79.77 JP9.RXI 59.86,79.67 59.86,75.1 57.72,72.96 57.72,69 v57.66,68.91
TX1
  Top 0.254: U1.28 52.44,59.65 52.44,50 55.79,46.65 55.79,31.31 55.69,31.2 JP1.1
VBAT  (via drill 0.6)
  Top 0.254: C23.1 75.91,60.77 72.96,63.72 68.7,63.72 68.09,63.11 66.97,63.11 U2.1 66.76,63.11 66.46,63.11 65.95,62.6 65.95,61.79 66.46,61.28 66.76,61.28 U2.3 | C23.1 75.66,60.66 75.66,59.66 78.66,56.66 78.66,55.66 79.66,54.66 | 76.66,60.66 C23.1
  Top 0.61: 76.16,60.66 C23.1 | 25.06,83.26 17.66,90.66 16.66,90.66 WING_FL.1 | 25.06,83.26 C15.1 | 80.66,82.66 77.66,82.66 76.66,81.66 | 76.66,81.66 v26.66,81.66 25.06,83.26 | 80.66,82.66 81.26,83.26 C18.1 | 76.66,81.66 81.66,76.66 81.66,56.66 79.66,54.66 | WING_BR.1 88.25,17.43 85.89,19.79 85.87,19.79 82.66,23 82.66,23.45 C14.1 81.26,24.06 78.66,26.66 | 78.66,26.66 77.66,27.66 U3.9 | WING_BL.1 16.01,17.82 16,17.82 23.45,25.26 C13.1 25.66,26.86 v25.66,31.66 | WING_FR.1 90.66,90.66 90.66,89.66 86.66,85.66 84.66,85.66 81.66,82.66 80.66,82.66 | 78.66,26.66 v78.66,28.66 | v78.66,42.66 78.66,50.66 77.66,51.66 77.66,52.66 79.66,54.66 | 79.66,54.66 JP3.2
  Bottom 0.61: v78.66,42.66 79.66,41.66 79.66,37.66 78.66,36.66 v78.66,28.66 | v25.66,31.66 25.66,80.66 v26.66,81.66

### Text on the board
tPlace: GND | DTR | REVISION...3?
tDocu: Changes: / -Reduced area to save weight / -Keepout underneath IMU based on official recommendation / -Most parts are 0603 for compactness / -Better placement on crystal and antenna / -Wings are made for 7mm motors / -Removed useless parts / -Moved connectors to match wire length / -Spaced out ISP and FTDI headers